# Altium schematic sheet eFuse.SchDoc
size A; SheetNumber: 7; SheetTotal: 10
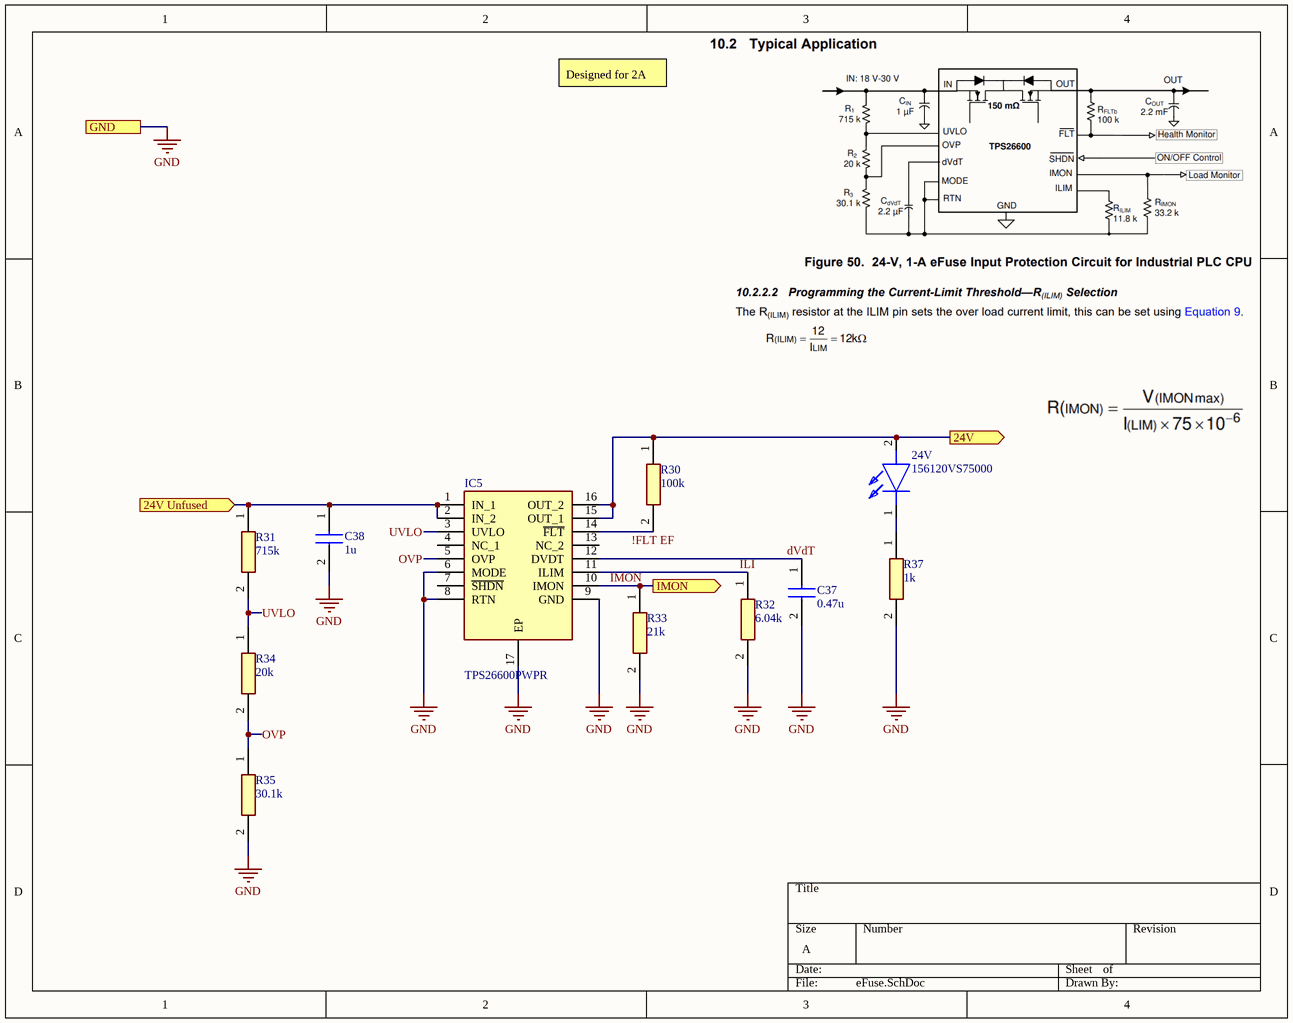
[diagram p0: eFuse.SchDoc]

## Parts
24V  156120VS75000  [156120VS75000]
C37  0.47u  [CAPC3216X152N]
C38  1u  [CAPC3216X178N]
IC5  TPS26600PWPR  [SOP65P640X120-17N]
R30  100k  [RESC3216X65N]
R31  715k  [RESC3216X70N]
R32  6.04k  [RESC3216X70N]
R33  21k  [RESC3216X70N]
R34  20k  [RESC3216X70N]
R35  30.1k  [RESC3216X70N]
R37  1k  [RESC3116X65N]

## Ports
24V (out), 24V Unfused (in), GND, IMON (out)

## Nets
GND: C37.2 C38.2 IC5.6(MODE) IC5.8(RTN) IC5.9(GND) IC5.17(EP) R32.2 R33.2 R35.2 R37.2 ; port GND
24V: 24V.2(A) IC5.15(OUT_1) IC5.16(OUT_2) R30.1 ; port 24V
24V Unfused: C38.1 IC5.1(IN_1) IC5.2(IN_2) R31.1 ; port 24V Unfused
!FLT EF: IC5.14(~{FLT}) R30.2
dVdT: C37.1 IC5.12(DVDT)
ILI: IC5.11(ILIM) R32.1
IMON: IC5.10(IMON) R33.1 ; port IMON
OVP: IC5.5(OVP) R34.2 R35.1
UVLO: IC5.3(UVLO) R31.2 R34.1
Net24V_1: 24V.1(K) R37.1

Not connected (* = marked no-connect by the designer): IC5 4(NC_1) 7(~{SHDN}) 13(NC_2)

## Notes on the sheet
- Designed for 2A

## Library data of the parts
24V = 156120VS75000: LED; Manufacturer_Name: Wurth Elektronik; Datasheet Link: https://www.we-online.com/components/products/datasheet/156120VS75000.pdf; Height: 1.3mm; Manufacturer_Part_Number: 156120VS75000; Mouser Part Number: 710-156120VS75000; Mouser Price/Stock: https://www.mouser.co.uk/ProductDetail/Wurth-Elektronik/156120VS75000?qs=2kOmHSv6VfQAUFg5BeuEfQ%3D%3D
C37 = KAF31ER71H474KL: Capacitor; Manufacturer_Name: Kyocera AVX; Datasheet Link: https://datasheets.kyocera-avx.com/AutoMLCCKAF.pdf; Height: 1.52mm; Manufacturer_Part_Number: KAF31ER71H474KL; Mouser Part Number: 581-KAF31ER71H474KL; Mouser Price/Stock: https://www.mouser.co.uk/ProductDetail/KYOCERA-AVX/KAF31ER71H474KL?qs=Jm2GQyTW%2FbjNZ75fHRRUJA%3D%3D; Arrow Part Number: KAF31ER71H474KL; Arrow Price/Stock: https://www.arrow.com/en/products/kaf31er71h474kl/avx?region=nac
C38 = KGF31GR72A105KU: Capacitor; Manufacturer_Name: Kyocera AVX; Datasheet Link: https://spicat.kyocera-avx.com/datasheet/KGF31GR72A105KU; Height: 1.78mm; Manufacturer_Part_Number: KGF31GR72A105KU; Mouser Part Number: 581-KGF31GR72A105KU; Mouser Price/Stock: https://www.mouser.co.uk/ProductDetail/KYOCERA-AVX/KGF31GR72A105KU?qs=Jm2GQyTW%2Fbi7xkmery9bvA%3D%3D; Arrow Part Number: KGF31GR72A105KU; Arrow Price/Stock: https://www.arrow.com/en/products/kgf31gr72a105ku/avx?utm_currency=USD&region=nac
IC5 = TPS26600PWPR: Integrated Circuit; Manufacturer_Name: Texas Instruments; Datasheet Link: http://www.ti.com/lit/gpn/tps2660; Height: 1.2mm; Manufacturer_Part_Number: TPS26600PWPR; Mouser Part Number: 595-TPS26600PWPR; Mouser Price/Stock: https://www.mouser.co.uk/ProductDetail/Texas-Instruments/TPS26600PWPR?qs=Bho%2FbeBaDExFVQBFO8fB%2FQ%3D%3D; Arrow Part Number: TPS26600PWPR; Arrow Price/Stock: https://www.arrow.com/en/products/tps26600pwpr/texas-instruments?region=nac
R30 = MCA1206ME1003BP500: Resistor; Manufacturer_Name: Vishay; Datasheet Link: https://www.vishay.com/docs/28700/mcx0x0xpre.pdf; Height: 0.65mm; Manufacturer_Part_Number: MCA1206ME1003BP500
R31 = ERA-8AEB7153V: Resistor; Manufacturer_Name: Panasonic; Datasheet Link: https://industrial.panasonic.com/cdbs/www-data/pdf/RDM0000/AOA0000C307.pdf; Height: 0.7mm; Manufacturer_Part_Number: ERA-8AEB7153V; Mouser Part Number: 667-ERA-8AEB7153V; Mouser Price/Stock: https://www.mouser.co.uk/ProductDetail/Panasonic/ERA-8AEB7153V?qs=MNPzkKEzRtQwT%2F%2F5AstjZA%3D%3D; Arrow Part Number: ERA-8AEB7153V; Arrow Price/Stock: https://www.arrow.com/en/products/era-8aeb7153v/panasonic
R32 = ERA-8AEB6041V: Resistor; Manufacturer_Name: Panasonic; Datasheet Link: https://industrial.panasonic.com/cdbs/www-data/pdf/RDM0000/AOA0000C307.pdf; Height: 0.7mm; Manufacturer_Part_Number: ERA-8AEB6041V
R33 = ERA-8AEB2102V: Resistor; Manufacturer_Name: Panasonic; Datasheet Link: https://industrial.panasonic.com/cdbs/www-data/pdf/RDM0000/AOA0000C307.pdf; Height: 0.7mm; Manufacturer_Part_Number: ERA-8AEB2102V; Mouser Part Number: 667-ERA-8AEB2102V; Mouser Price/Stock: https://www.mouser.co.uk/ProductDetail/Panasonic/ERA-8AEB2102V?qs=MNPzkKEzRtSGOL2oFTGtSQ%3D%3D
R34 = ERA-8ARB203V: Resistor; Manufacturer_Name: Panasonic; Datasheet Link: https://industrial.panasonic.com/cdbs/www-data/pdf/RDM0000/AOA0000C307.pdf; Height: 0.7mm; Manufacturer_Part_Number: ERA-8ARB203V; Mouser Part Number: 667-ERA-8ARB203V; Mouser Price/Stock: https://www.mouser.co.uk/ProductDetail/Panasonic/ERA-8ARB203V?qs=6%252Bc%252B2ke79U6sTVaKLKhC4g%3D%3D
R35 = ERA-8AEB3012V: Resistor; Manufacturer_Name: Panasonic; Datasheet Link: https://industrial.panasonic.com/cdbs/www-data/pdf/RDM0000/AOA0000C307.pdf; Height: 0.7mm; Manufacturer_Part_Number: ERA-8AEB3012V; Mouser Part Number: 667-ERA-8AEB3012V; Mouser Price/Stock: https://www.mouser.co.uk/ProductDetail/Panasonic/ERA-8AEB3012V?qs=MNPzkKEzRtRrrEBjINaeEw%3D%3D; Arrow Part Number: ERA-8AEB3012V; Arrow Price/Stock: https://www.arrow.com/en/products/era-8aeb3012v/panasonic
R37 = CRGS1206J1K0: Resistor; Manufacturer_Name: TE Connectivity; Datasheet Link: https://www.te.com/commerce/DocumentDelivery/DDEController?Action=srchrtrv&DocNm=9-1773463-8&DocType=Data%20Sheet&DocLang=English&PartCntxt=3-2176245-7&DocFormat=pdf; Height: 0.65mm; Manufacturer_Part_Number: CRGS1206J1K0; Mouser Part Number: 279-CRGS1206J1K0; Mouser Price/Stock: https://www.mouser.com/Search/Refine.aspx?Keyword=279-CRGS1206J1K0